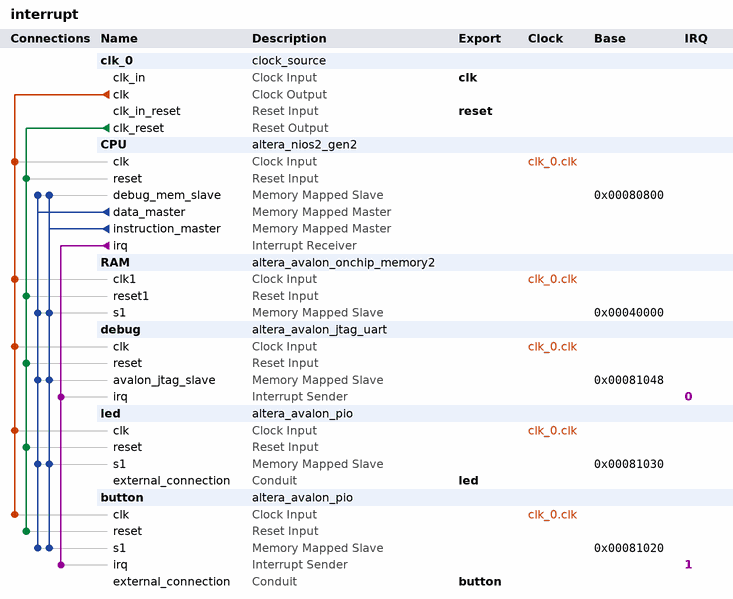
[diagram p0: system contents]
# Platform Designer (Qsys) system interrupt, Cyclone IV E EP4CE115F29C7
# Parameters at their usual value, and those the tool derives, are not listed.
package require -exact qsys 17.1
create_system interrupt
set_project_property DEVICE_FAMILY {Cyclone IV E}
set_project_property DEVICE EP4CE115F29C7

add_instance clk_0 clock_source 17.1
set_instance_parameter_value clk_0 clockFrequency 50000000

add_instance CPU altera_nios2_gen2 17.1
set_instance_parameter_value CPU dcache_size 2048
set_instance_parameter_value CPU exceptionSlave RAM.s1
set_instance_parameter_value CPU icache_size 4096
set_instance_parameter_value CPU impl Tiny
set_instance_parameter_value CPU resetSlave RAM.s1

add_instance RAM altera_avalon_onchip_memory2 17.1
set_instance_parameter_value RAM dataWidth 32
set_instance_parameter_value RAM dualPort false
set_instance_parameter_value RAM initMemContent true
set_instance_parameter_value RAM initializationFileName onchip_mem.hex
set_instance_parameter_value RAM memorySize 204800

add_instance debug altera_avalon_jtag_uart 17.1
set_instance_parameter_value debug simInteractiveOptions NO_INTERACTIVE_WINDOWS

add_instance led altera_avalon_pio 17.1
set_instance_parameter_value led direction Output
set_instance_parameter_value led width 1

add_instance button altera_avalon_pio 17.1
set_instance_parameter_value button captureEdge true
set_instance_parameter_value button direction Input
set_instance_parameter_value button edgeType FALLING
set_instance_parameter_value button generateIRQ true
set_instance_parameter_value button irqType EDGE
set_instance_parameter_value button width 1

# connections
add_connection clk_0.clk button.clk clock
add_connection clk_0.clk CPU.clk clock
add_connection clk_0.clk debug.clk clock
add_connection clk_0.clk led.clk clock
add_connection clk_0.clk RAM.clk1 clock
add_connection clk_0.clk_reset button.reset reset
add_connection clk_0.clk_reset CPU.reset reset
add_connection clk_0.clk_reset debug.reset reset
add_connection clk_0.clk_reset led.reset reset
add_connection clk_0.clk_reset RAM.reset1 reset
add_connection CPU.data_master button.s1 avalon
set_connection_parameter_value CPU.data_master/button.s1 baseAddress 0x00081020
add_connection CPU.data_master CPU.debug_mem_slave avalon
set_connection_parameter_value CPU.data_master/CPU.debug_mem_slave baseAddress 0x00080800
add_connection CPU.data_master debug.avalon_jtag_slave avalon
set_connection_parameter_value CPU.data_master/debug.avalon_jtag_slave baseAddress 0x00081048
add_connection CPU.data_master led.s1 avalon
set_connection_parameter_value CPU.data_master/led.s1 baseAddress 0x00081030
add_connection CPU.data_master RAM.s1 avalon
set_connection_parameter_value CPU.data_master/RAM.s1 baseAddress 0x00040000
add_connection CPU.instruction_master button.s1 avalon
set_connection_parameter_value CPU.instruction_master/button.s1 baseAddress 0x00081020
add_connection CPU.instruction_master CPU.debug_mem_slave avalon
set_connection_parameter_value CPU.instruction_master/CPU.debug_mem_slave baseAddress 0x00080800
add_connection CPU.instruction_master debug.avalon_jtag_slave avalon
set_connection_parameter_value CPU.instruction_master/debug.avalon_jtag_slave baseAddress 0x00081048
add_connection CPU.instruction_master led.s1 avalon
set_connection_parameter_value CPU.instruction_master/led.s1 baseAddress 0x00081030
add_connection CPU.instruction_master RAM.s1 avalon
set_connection_parameter_value CPU.instruction_master/RAM.s1 baseAddress 0x00040000
add_connection CPU.irq button.irq interrupt
set_connection_parameter_value CPU.irq/button.irq irqNumber 1
add_connection CPU.irq debug.irq interrupt
set_connection_parameter_value CPU.irq/debug.irq irqNumber 0

# exported interfaces
add_interface button conduit end
set_interface_property button EXPORT_OF button.external_connection
add_interface clk clock sink
set_interface_property clk EXPORT_OF clk_0.clk_in
add_interface led conduit end
set_interface_property led EXPORT_OF led.external_connection
add_interface reset reset sink
set_interface_property reset EXPORT_OF clk_0.clk_in_reset

set_interconnect_requirement {$system} qsys_mm.clockCrossingAdapter HANDSHAKE
set_interconnect_requirement {$system} qsys_mm.enableEccProtection FALSE
set_interconnect_requirement {$system} qsys_mm.insertDefaultSlave FALSE
set_interconnect_requirement {$system} qsys_mm.maxAdditionalLatency 1

save_system interrupt.qsys
